# Altium schematic sheet Fuse_Ref.SchDoc
size A4
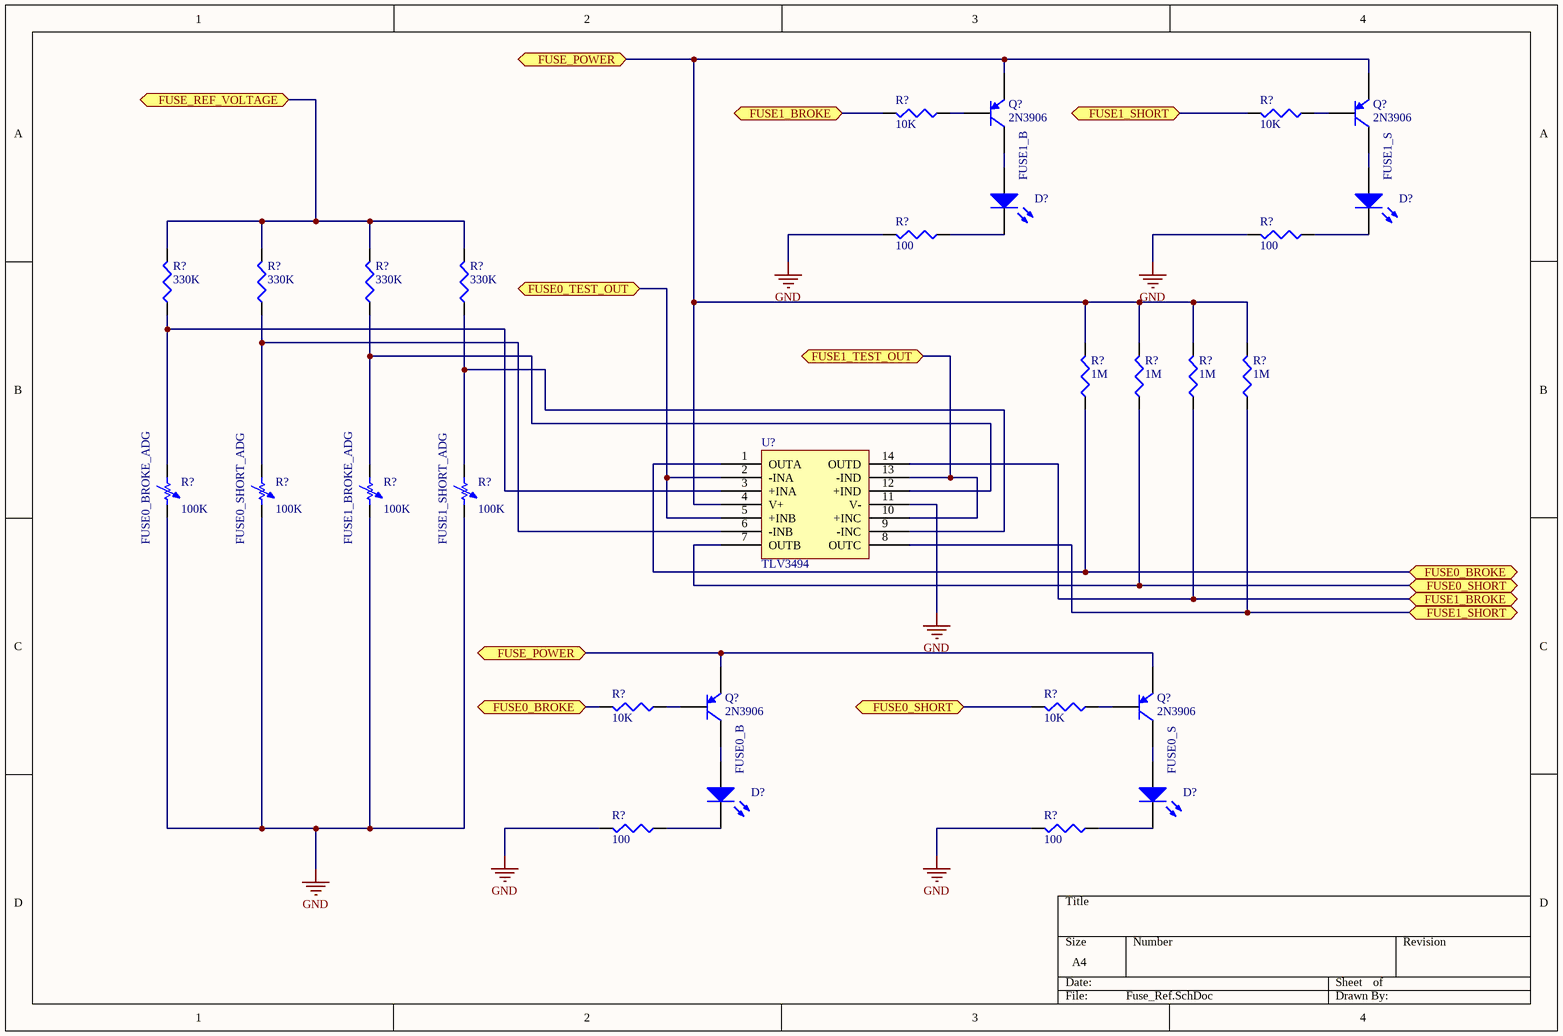
[diagram p0: Fuse_Ref.SchDoc]

## Parts
(Parts that share a designator on the sheet are numbered #1, #2 ... from top to bottom, then left to right.)
D?#1  FUSE1_B  [3.2X1.6X1.1]
D?#2  FUSE1_S  [3.2X1.6X1.1]
D?#3  FUSE0_B  [3.2X1.6X1.1]
D?#4  FUSE0_S  [3.2X1.6X1.1]
Q?#1  2N3906  [SOT-23B_N]
Q?#2  2N3906  [SOT-23B_N]
Q?#3  2N3906  [SOT-23B_N]
Q?#4  2N3906  [SOT-23B_N]
R?#1  value 10K  [12Z-2010]  (hidden comment: Res3)
R?#2  value 10K  [12Z-2010]  (hidden comment: Res3)
R?#3  value 100  [12Z-2010]  (hidden comment: Res3)
R?#4  value 100  [12Z-2010]  (hidden comment: Res3)
R?#5  value 330K  [12Z-2010]  (hidden comment: Res3)
R?#6  value 330K  [12Z-2010]  (hidden comment: Res3)
R?#7  value 330K  [12Z-2010]  (hidden comment: Res3)
R?#8  value 330K  [12Z-2010]  (hidden comment: Res3)
R?#9  value 1M  [12Z-2010]  (hidden comment: Res3)
R?#10  value 1M  [12Z-2010]  (hidden comment: Res3)
R?#11  value 1M  [12Z-2010]  (hidden comment: Res3)
R?#12  value 1M  [12Z-2010]  (hidden comment: Res3)
R?#13  value 100K  [AXIAL-0.7]  (hidden comment: Res Adj1)
R?#14  value 100K  [AXIAL-0.7]  (hidden comment: Res Adj1)
R?#15  value 100K  [AXIAL-0.7]  (hidden comment: Res Adj1)
R?#16  value 100K  [AXIAL-0.7]  (hidden comment: Res Adj1)
R?#17  value 10K  [12Z-2010]  (hidden comment: Res3)
R?#18  value 10K  [12Z-2010]  (hidden comment: Res3)
R?#19  value 100  [12Z-2010]  (hidden comment: Res3)
R?#20  value 100  [12Z-2010]  (hidden comment: Res3)
U?  TLV3494

## Ports
FUSE0_BROKE (bidir), FUSE0_SHORT (bidir), FUSE0_TEST_OUT (bidir), FUSE1_BROKE (bidir), FUSE1_SHORT (bidir), FUSE1_TEST_OUT (bidir), FUSE_POWER (bidir), FUSE_REF_VOLTAGE (bidir)

## Nets
GND: R?#3.2 R?#4.2 R?#13.2 R?#14.2 R?#15.2 R?#16.2 R?#19.2 R?#20.2 U?.11(V-)
FUSE0_BROKE: R?#9.1 R?#17.2 U?.1(OUTA) ; port FUSE0_BROKE
FUSE0_SHORT: R?#10.1 R?#18.2 U?.7(OUTB) ; port FUSE0_SHORT
FUSE0_TEST_OUT: U?.2(-INA) U?.5(+INB) ; port FUSE0_TEST_OUT
FUSE1_BROKE: R?#1.2 R?#11.1 U?.14(OUTD) ; port FUSE1_BROKE
FUSE1_SHORT: R?#2.2 R?#12.1 U?.8(OUTC) ; port FUSE1_SHORT
FUSE1_TEST_OUT: U?.10(+INC) U?.13(-IND) ; port FUSE1_TEST_OUT
FUSE_POWER: Q?#1.3(E) Q?#2.3(E) Q?#3.3(E) Q?#4.3(E) R?#9.2 R?#10.2 R?#11.2 R?#12.2 U?.4(V+) ; port FUSE_POWER
FUSE_REF_VOLTAGE: R?#5.2 R?#6.2 R?#7.2 R?#8.2 ; port FUSE_REF_VOLTAGE
NetD?#1_1: D?#1.1(A) Q?#1.1(C)
NetD?#1_2: D?#1.2(K) R?#3.1
NetD?#2_1: D?#2.1(A) Q?#2.1(C)
NetD?#2_2: D?#2.2(K) R?#4.1
NetD?#3_1: D?#3.1(A) Q?#3.1(C)
NetD?#3_2: D?#3.2(K) R?#19.1
NetD?#4_1: D?#4.1(A) Q?#4.1(C)
NetD?#4_2: D?#4.2(K) R?#20.1
NetQ?#1_2: Q?#1.2(B) R?#1.1
NetQ?#2_2: Q?#2.2(B) R?#2.1
NetQ?#3_2: Q?#3.2(B) R?#17.1
NetQ?#4_2: Q?#4.2(B) R?#18.1
NetR?#5_1: R?#5.1 R?#13.1 U?.3(+INA)
NetR?#6_1: R?#6.1 R?#14.1 U?.6(-INB)
NetR?#7_1: R?#7.1 R?#15.1 U?.12(+IND)
NetR?#8_1: R?#8.1 R?#16.1 U?.9(-INC)

## Notes on the sheet
- (near R?#13) FUSE0_BROKE_ADG
- (near R?#14) FUSE0_SHORT_ADG
- (near R?#15) FUSE1_BROKE_ADG
- (near R?#16) FUSE1_SHORT_ADG

## Library data of the parts
D?#1-D?#4 = LED2: Typical RED, GREEN, YELLOW, AMBER GaAs LED; Published: 8-Jun-2000; LatestRevisionDate: 17-Jul-2002; LatestRevisionNote: Re-released for DXP Platform.; PackageVersion: Feb-2002; PackageReference: 3.2X1.6X1.1; Publisher: Altium Limited; PackageDescription: SM LED; 2 Flat Leads
Q?#1-Q?#4 = PNP: PNP Bipolar Transistor; Published: 8-Jun-2000; LatestRevisionDate: 29-May-2009; LatestRevisionNote: IPC-7351 Footprint Added.; PackageVersion: Aug-1999; PackageReference: SOT-23B; Publisher: Altium Limited; PackageDescription: 3-Pin SOT-23 Package 0.95 mm Pitch, 2.4 mm Lead Span
R?#1-R?#12 R?#17-R?#20 = Res3: Resistor; Published: 8-Jun-2000; LatestRevisionDate: 29-May-2009; LatestRevisionNote: IPC-7351 Footprint Added.; PackageReference: J1-0603; Publisher: Altium Limited; PackageDescription: Chip Resistor
R?#13-R?#16 = Res Adj1: Variable Resistor; Set Position: 0.5; Published: 8-Jun-2000; LatestRevisionDate: 17-Jul-2002; LatestRevisionNote: Re-released for DXP Platform.; PackageReference: AXIAL-0.7; Publisher: Altium Limited; PackageDescription: Axial Device, Thru-Hole; 2 Leads; 0.7 in Pin Spacing